# EAGLE design Stepperdriver (EAGLE 6.5.0)
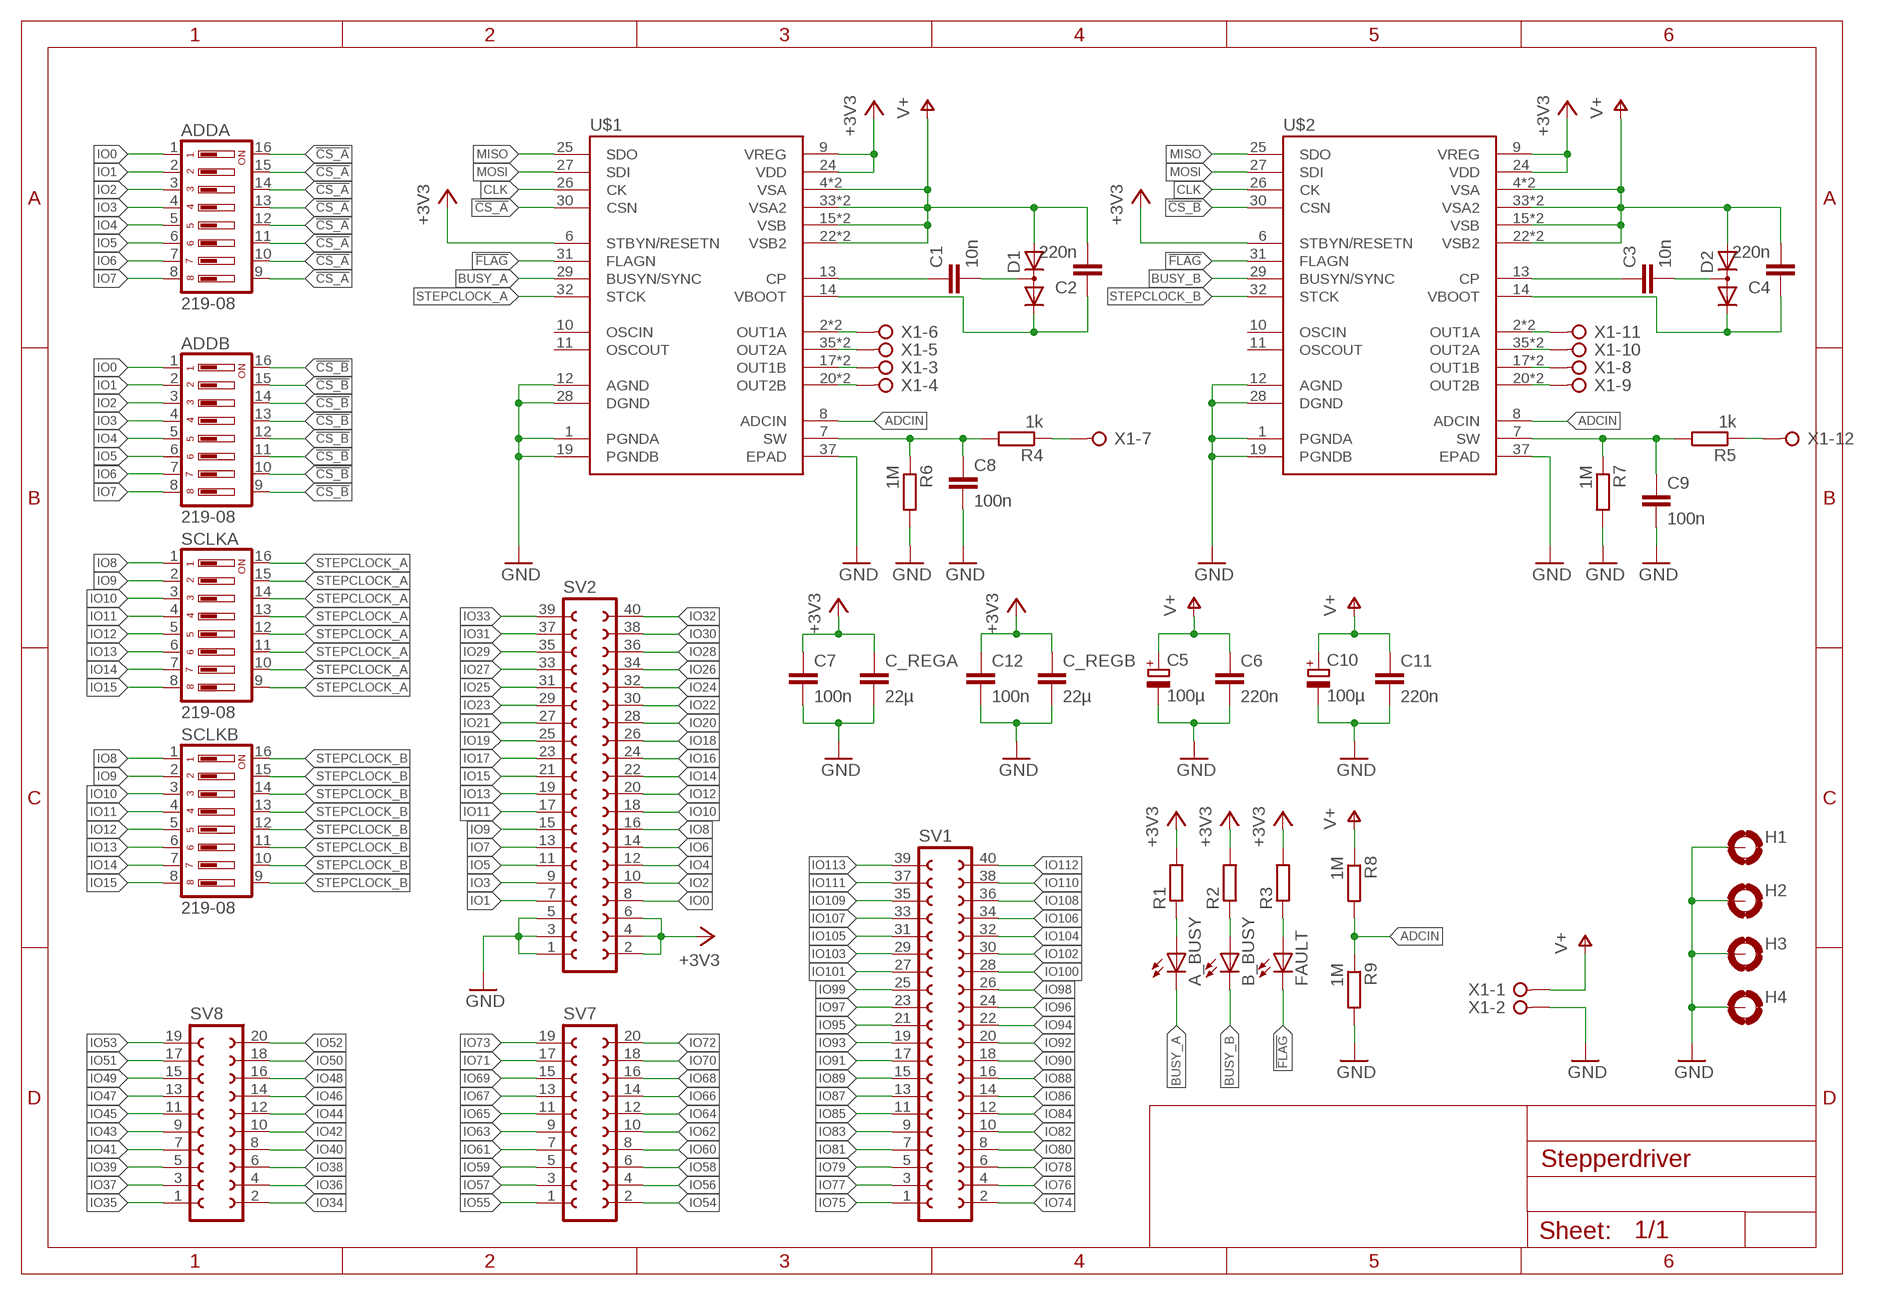
[diagram p0: schematic, sheet 1]

## Parts
A_BUSY  LEDCHIP-LED0805  [CHIP-LED0805]
ADDA  219-08  [CTS-219-08]
ADDB  219-08  [CTS-219-08]
B_BUSY  LEDCHIP-LED0805  [CHIP-LED0805]
C1  10n  C-EUC0805  [C0805]
C2  220n  C-EUC0805  [C0805]
C3  10n  C-EUC0805  [C0805]
C4  220n  C-EUC0805  [C0805]
C5  100µ  CPOL-EU150CLZ-1010  [150CLZ-1010]
C6  220n  C-EUC0805  [C0805]
C7  100n  C-EUC0805  [C0805]
C8  100n  C-EUC0805  [C0805]
C9  100n  C-EUC0805  [C0805]
C10  100µ  CPOL-EU150CLZ-1010  [150CLZ-1010]
C11  220n  C-EUC0805  [C0805]
C12  100n  C-EUC0805  [C0805]
C_REGA  22µ  C-EUC0805  [C0805]
C_REGB  22µ  C-EUC0805  [C0805]
D1  DIODE_2CACA-SOT23  [SOT23]
D2  DIODE_2CACA-SOT23  [SOT23]
FAULT  LEDCHIP-LED0805  [CHIP-LED0805]
H1  MOUNT-PAD-ROUND5.0  [5,0-PAD]
H2  MOUNT-PAD-ROUND5.0  [5,0-PAD]
H3  MOUNT-PAD-ROUND5.0  [5,0-PAD]
H4  MOUNT-PAD-ROUND5.0  [5,0-PAD]
R1  R-EU_R0805  [R0805]
R2  R-EU_R0805  [R0805]
R3  R-EU_R0805  [R0805]
R4  1k  R-EU_R0805  [R0805]
R5  1k  R-EU_R0805  [R0805]
R6  1M  R-EU_R0805  [R0805]
R7  1M  R-EU_R0805  [R0805]
R8  1M  R-EU_R0805  [R0805]
R9  1M  R-EU_R0805  [R0805]
SCLKA  219-08  [CTS-219-08]
SCLKB  219-08  [CTS-219-08]
SV1  FE20-2  [FE20-2]
SV2  FE20-2  [FE20-2]
SV7  FE10-2  [FE10-2]
SV8  FE10-2  [FE10-2]
U$1  L6470HPOWERSO36  [SOP65P1400X360-37N]
U$2  L6470HPOWERSO36  [SOP65P1400X360-37N]
X1  W237-12P  [W237-12P]

## Nets
!CS_A: ADDA.9 ADDA.10 ADDA.11 ADDA.12 ADDA.13 ADDA.14 ADDA.15 ADDA.16 U$1.30(CSN)
!CS_B: ADDB.9 ADDB.10 ADDB.11 ADDB.12 ADDB.13 ADDB.14 ADDB.15 ADDB.16 U$2.30(CSN)
!FLAG: FAULT.C U$1.31(FLAGN) U$2.31(FLAGN)
+3V3: C7.1 C12.1 C_REGA.1 C_REGB.1 R1.2 R2.2 R3.2 SV2.2 SV2.4 SV2.6 U$1.6(STBYN/RESETN) U$1.9(VREG) U$1.24(VDD) U$2.6(STBYN/RESETN) U$2.9(VREG) U$2.24(VDD)
ADCIN: R8.2 R9.1 U$1.8(ADCIN) U$2.8(ADCIN)
BUSY_A: A_BUSY.C U$1.29(BUSYN/SYNC)
BUSY_B: B_BUSY.C U$2.29(BUSYN/SYNC)
CLK: U$1.26(CK) U$2.26(CK)
GND: C5.- C6.2 C7.2 C8.2 C9.2 C10.- C11.2 C12.2 C_REGA.2 C_REGB.2 H1.B5(MOUNT) H2.B5(MOUNT) H3.B5(MOUNT) H4.B5(MOUNT) R6.2 R7.2 R9.2 SV2.1 SV2.3 SV2.5 U$1.1(PGNDA) U$1.12(AGND) U$1.19(PGNDB) U$1.28(DGND) U$1.37(EPAD) U$2.1(PGNDA) U$2.12(AGND) U$2.19(PGNDB) U$2.28(DGND) U$2.37(EPAD) X1.2
IO0: ADDA.1 ADDB.1 SV2.8
IO1: ADDA.2 ADDB.2 SV2.7
IO2: ADDA.3 ADDB.3 SV2.10
IO3: ADDA.4 ADDB.4 SV2.9
IO4: ADDA.5 ADDB.5 SV2.12
IO5: ADDA.6 ADDB.6 SV2.11
IO6: ADDA.7 ADDB.7 SV2.14
IO7: ADDA.8 ADDB.8 SV2.13
IO8: SCLKA.1 SCLKB.1 SV2.16
IO9: SCLKA.2 SCLKB.2 SV2.15
IO10: SCLKA.3 SCLKB.3 SV2.18
IO11: SCLKA.4 SCLKB.4 SV2.17
IO12: SCLKA.5 SCLKB.5 SV2.20
IO13: SCLKA.6 SCLKB.6 SV2.19
IO14: SCLKA.7 SCLKB.7 SV2.22
IO15: SCLKA.8 SCLKB.8 SV2.21
IO16: SV2.24
IO17: SV2.23
IO18: SV2.26
IO19: SV2.25
IO20: SV2.28
IO21: SV2.27
IO22: SV2.30
IO23: SV2.29
IO24: SV2.32
IO25: SV2.31
IO26: SV2.34
IO27: SV2.33
IO28: SV2.36
IO29: SV2.35
IO30: SV2.38
IO31: SV2.37
IO32: SV2.40
IO33: SV2.39
IO34: SV8.2
IO35: SV8.1
IO36: SV8.4
IO37: SV8.3
IO38: SV8.6
IO39: SV8.5
IO40: SV8.8
IO41: SV8.7
IO42: SV8.10
IO43: SV8.9
IO44: SV8.12
IO45: SV8.11
IO46: SV8.14
IO47: SV8.13
IO48: SV8.16
IO49: SV8.15
IO50: SV8.18
IO51: SV8.17
IO52: SV8.20
IO53: SV8.19
IO54: SV7.2
IO55: SV7.1
IO56: SV7.4
IO57: SV7.3
IO58: SV7.6
IO59: SV7.5
IO60: SV7.8
IO61: SV7.7
IO62: SV7.10
IO63: SV7.9
IO64: SV7.12
IO65: SV7.11
IO66: SV7.14
IO67: SV7.13
IO68: SV7.16
IO69: SV7.15
IO70: SV7.18
IO71: SV7.17
IO72: SV7.20
IO73: SV7.19
IO74: SV1.2
IO75: SV1.1
IO76: SV1.4
IO77: SV1.3
IO78: SV1.6
IO79: SV1.5
IO80: SV1.8
IO81: SV1.7
IO82: SV1.10
IO83: SV1.9
IO84: SV1.12
IO85: SV1.11
IO86: SV1.14
IO87: SV1.13
IO88: SV1.16
IO89: SV1.15
IO90: SV1.18
IO91: SV1.17
IO92: SV1.20
IO93: SV1.19
IO94: SV1.22
IO95: SV1.21
IO96: SV1.24
IO97: SV1.23
IO98: SV1.26
IO99: SV1.25
IO100: SV1.28
IO101: SV1.27
IO102: SV1.30
IO103: SV1.29
IO104: SV1.32
IO105: SV1.31
IO106: SV1.34
IO107: SV1.33
IO108: SV1.36
IO109: SV1.35
IO110: SV1.38
IO111: SV1.37
IO112: SV1.40
IO113: SV1.39
MISO: U$1.25(SDO) U$2.25(SDO)
MOSI: U$1.27(SDI) U$2.27(SDI)
N$1: U$1.2(OUT1A) U$1.3(OUT1A) X1.6
N$2: U$1.35(OUT2A) U$1.36(OUT2A) X1.5
N$3: U$1.17(OUT1B) U$1.18(OUT1B) X1.3
N$4: U$1.20(OUT2B) U$1.21(OUT2B) X1.4
N$5: U$2.20(OUT2B) U$2.21(OUT2B) X1.9
N$6: U$2.17(OUT1B) U$2.18(OUT1B) X1.8
N$7: U$2.35(OUT2A) U$2.36(OUT2A) X1.10
N$8: U$2.2(OUT1A) U$2.3(OUT1A) X1.11
N$61: C3.1 U$2.13(CP)
N$62: C3.2 D2.3(AC)
N$63: C4.1 D2.2(C) U$2.14(VBOOT)
N$67: A_BUSY.A R1.1
N$71: C1.1 U$1.13(CP)
N$74: C1.2 D1.3(AC)
N$75: C2.1 D1.2(C) U$1.14(VBOOT)
N$76: R5.1 X1.12
N$77: B_BUSY.A R2.1
N$78: FAULT.A R3.1
N$82: C9.1 R5.2 R7.1 U$2.7(SW)
N$83: C8.1 R4.2 R6.1 U$1.7(SW)
N$84: R4.1 X1.7
STEPCLOCK_A: SCLKA.9 SCLKA.10 SCLKA.11 SCLKA.12 SCLKA.13 SCLKA.14 SCLKA.15 SCLKA.16 U$1.32(STCK)
STEPCLOCK_B: SCLKB.9 SCLKB.10 SCLKB.11 SCLKB.12 SCLKB.13 SCLKB.14 SCLKB.15 SCLKB.16 U$2.32(STCK)
V+: C2.2 C4.2 C5.+ C6.1 C10.+ C11.1 D1.1(A) D2.1(A) R8.1 U$1.4(VSA) U$1.5(VSA) U$1.15(VSB) U$1.16(VSB) U$1.22(VSB2) U$1.23(VSB2) U$1.33(VSA2) U$1.34(VSA2) U$2.4(VSA) U$2.5(VSA) U$2.15(VSB) U$2.16(VSB) U$2.22(VSB2) U$2.23(VSB2) U$2.33(VSA2) U$2.34(VSA2) X1.1
Unconnected: U$1.10(OSCIN) U$1.11(OSCOUT) U$2.10(OSCIN) U$2.11(OSCOUT)

## Library data of the parts
A_BUSY B_BUSY FAULT = led:LED: LED OSRAM: - CHIPLED LG R971, LG N971, LY N971, LG Q971, LY Q971, LO R971, LY R971 LH N974, LH R974 LS Q976, LO Q976, LY Q976 LO Q996 - Hyper CHIPLED LW Q18S LB Q993, LB Q99A, LB R99A - SideLED LS A670, LO A670, LY A670, LG A670, LP A670 LB A673, LV A673, LT A673, LW A673 LH A674 LY A675 LS A676, LA A676, LO A676, LY A676, LW A676 LS A679, LY A679, LG A679 - Hyper Micro SIDELED® LS Y876, LA Y876, LO Y876, LY Y876 LT Y87S - SmartLED LW L88C, LW L88S LB L89C, LB L89S, LG L890 LS L89K, LO L89K, LY L89K LS L896, LA L896, LO L896, LY L896 - TOPLED LS T670, LO T670, LY T670, LG T670, LP T670 LSG T670, LSP T670, LSY T670, LOP T670, LYG T670 LG T671, LOG T671, LSG T671 LB T673, LV T673, LT T673, LW T673 LH T674 LS T676, LA T676, LO T676, LY T676, LB T676, LH T676, LSB T676, LW T676 LB T67C, LV T67C, LT T67C, LS T67K, LO T67K, LY T67K, LW E67C LS E67B, LA E67B, LO E67B, LY E67B, LB E67C, LV E67C, LT E67C LW T67C LS T679, LY T679, LG T679 LS T770, LO T770, LY T770, LG T770, LP T770 LB T773, LV T773, LT T773, LW T773 LH T774 LS E675, LA E675, LY E675, LS T675 LS T776, LA T776, LO T776, LY T776, LB T776 LHGB T686 LT T68C, LB T68C - Hyper Mini TOPLED® LB M676 - Mini TOPLED Santana® LG M470 LS M47K, LO M47K, LY M47K Source: http://www.osram.convergy.de LUXEON: - LUMILED® LXK2-PW12-R00, LXK2-PW12-S00, LXK2-PW14-U00, LXK2-PW14-V00 LXK2-PM12-R00, LXK2-PM12-S00, LXK2-PM14-U00 LXK2-PE12-Q00, LXK2-PE12-R00, LXK2-PE12-S00, LXK2-PE14-T00, LXK2-PE14-U00 LXK2-PB12-K00, LXK2-PB12-L00, LXK2-PB12-M00, LXK2-PB14-N00, LXK2-PB14-P00, LXK2-PB14-Q00 LXK2-PR12-L00, LXK2-PR12-M00, LXK2-PR14-Q00, LXK2-PR14-R00 LXK2-PD12-Q00, LXK2-PD12-R00, LXK2-PD12-S00 LXK2-PH12-R00, LXK2-PH12-S00 LXK2-PL12-P00, LXK2-PL12-Q00, LXK2-PL12-R00 Source: www.luxeon.com KINGBRIGHT: KA-3528ASYC Source: www.kingbright.com
ADDA ADDB SCLKA SCLKB = switch-dil:219-08*: Surface Mount DIP Switch Series 219 SMT CTS Electronic Components Sourc: www.ctscorp.com; OC_FARNELL: unknown; OC_NEWARK: unknown
C1-C4 C6-C9 C11 C12 C_REGA C_REGB = rcl:C-EU: CAPACITOR, European symbol
C5 C10 = rcl:CPOL-EU: POLARIZED CAPACITOR, European symbol
D1 D2 = diode:DIODE_2CACA-: 2 Diodes - Cathode-Anode|Cathode-Anode
H1-H4 = holes:MOUNT-PAD-ROUND: MOUNTING PAD, round
R1-R9 = rcl:R-EU_: RESISTOR, European symbol
SV1 SV2 = con-lsta:FE20-2: FEMALE HEADER; OC_FARNELL: unknown; OC_NEWARK: unknown
SV7 SV8 = con-lsta:FE10-2: FEMALE HEADER; OC_FARNELL: unknown; OC_NEWARK: unknown
U$1 U$2 = Hardware:L6470H
X1 = con-wago-508:W237-12P: WAGO SREW CLAMP; OC_FARNELL: unknown; OC_NEWARK: unknown

## Board
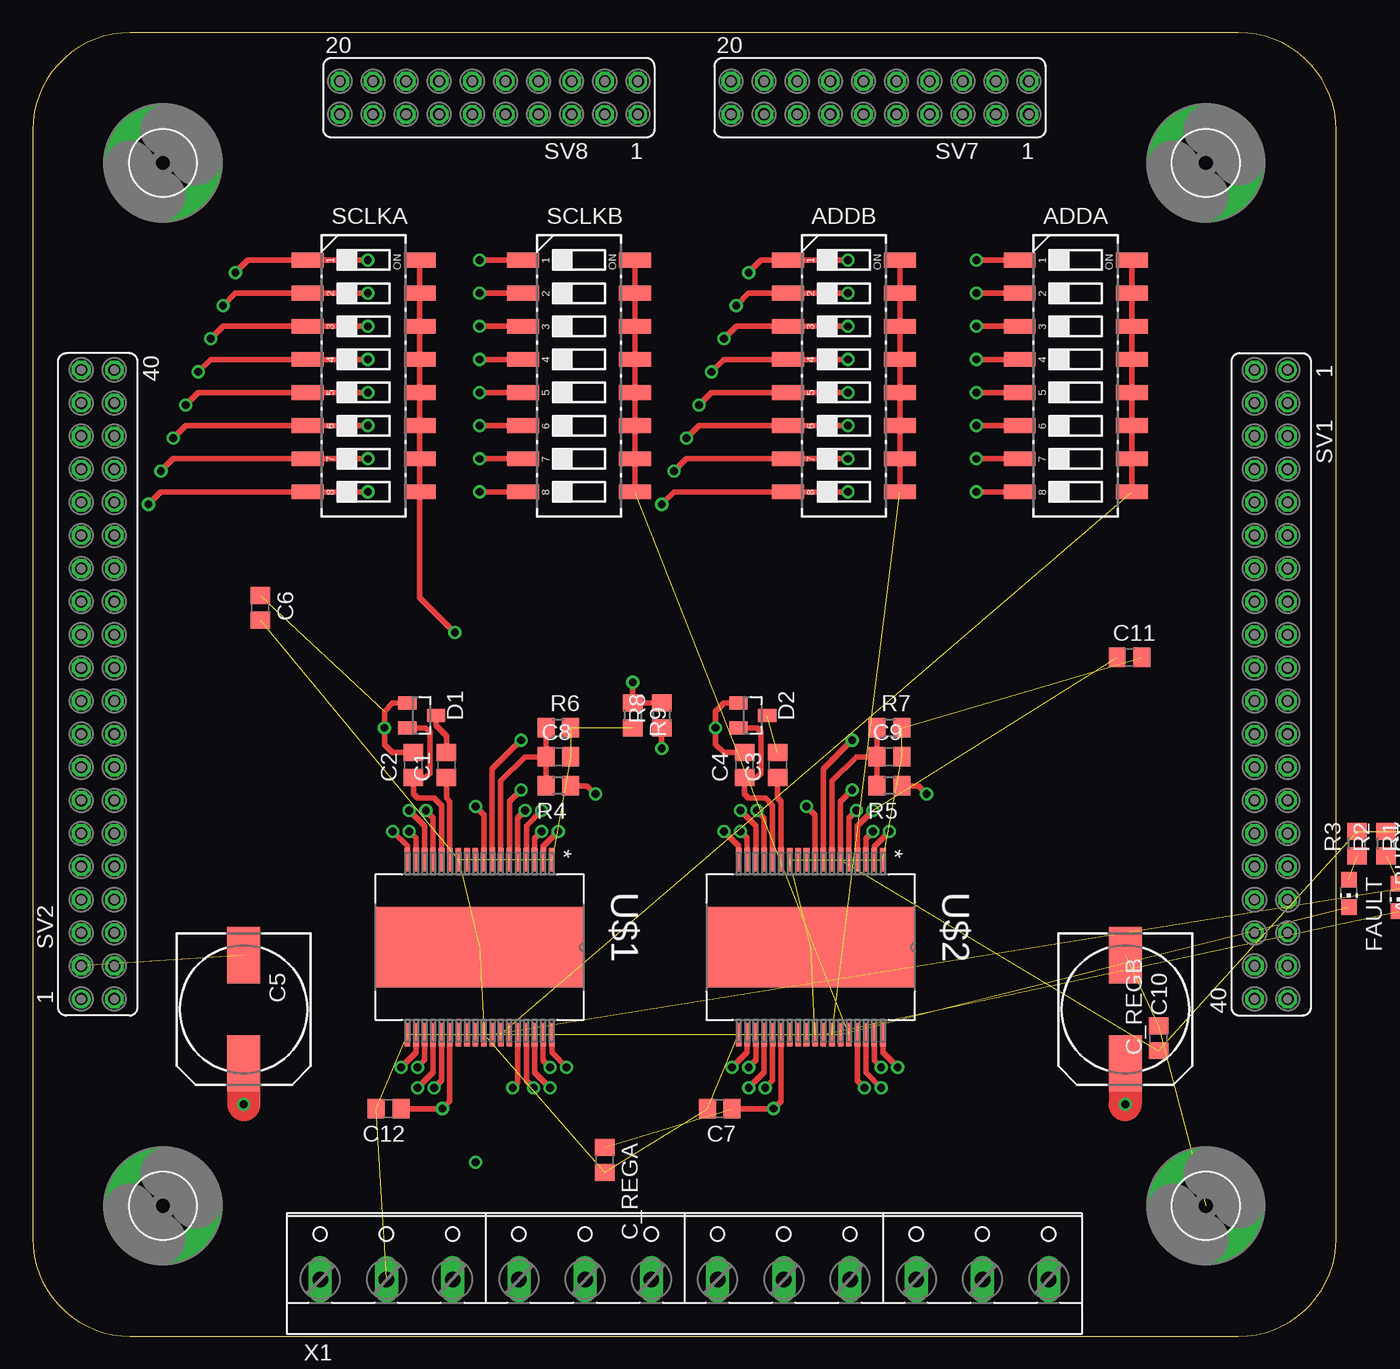
[diagram p1: board, top side]
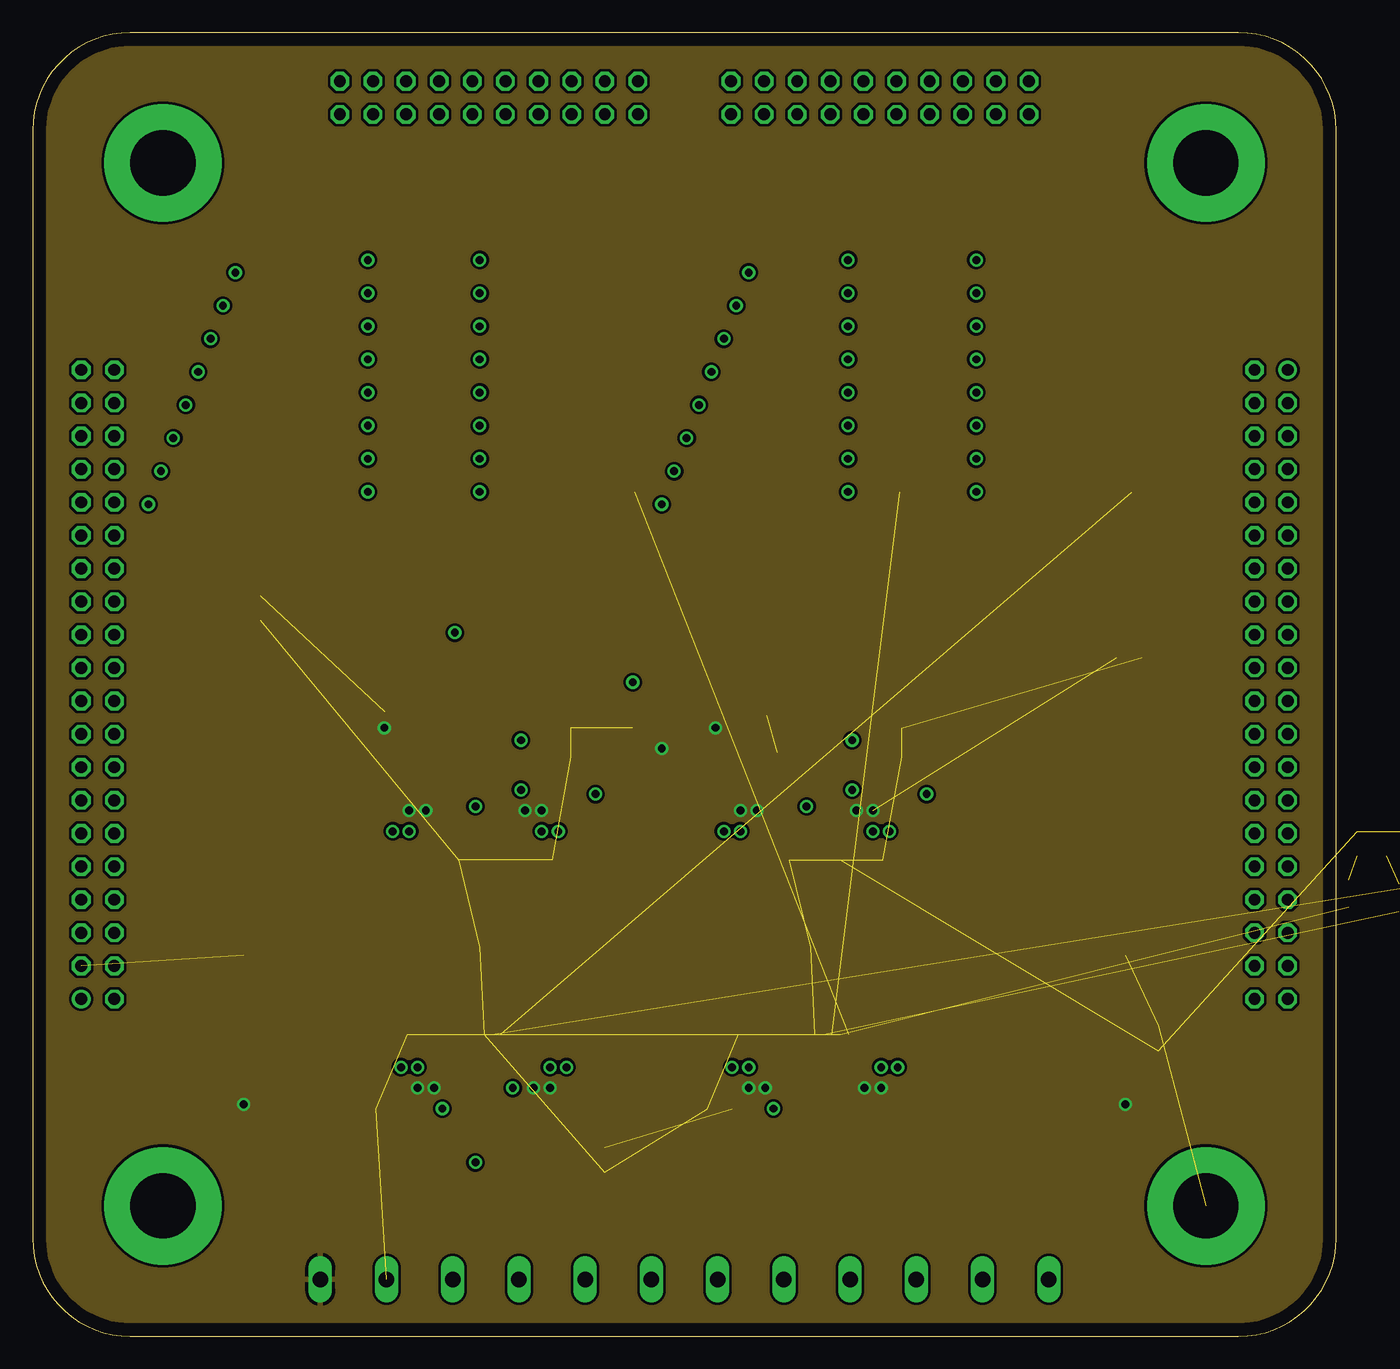
[diagram p2: board, inner layer PowerVCC]
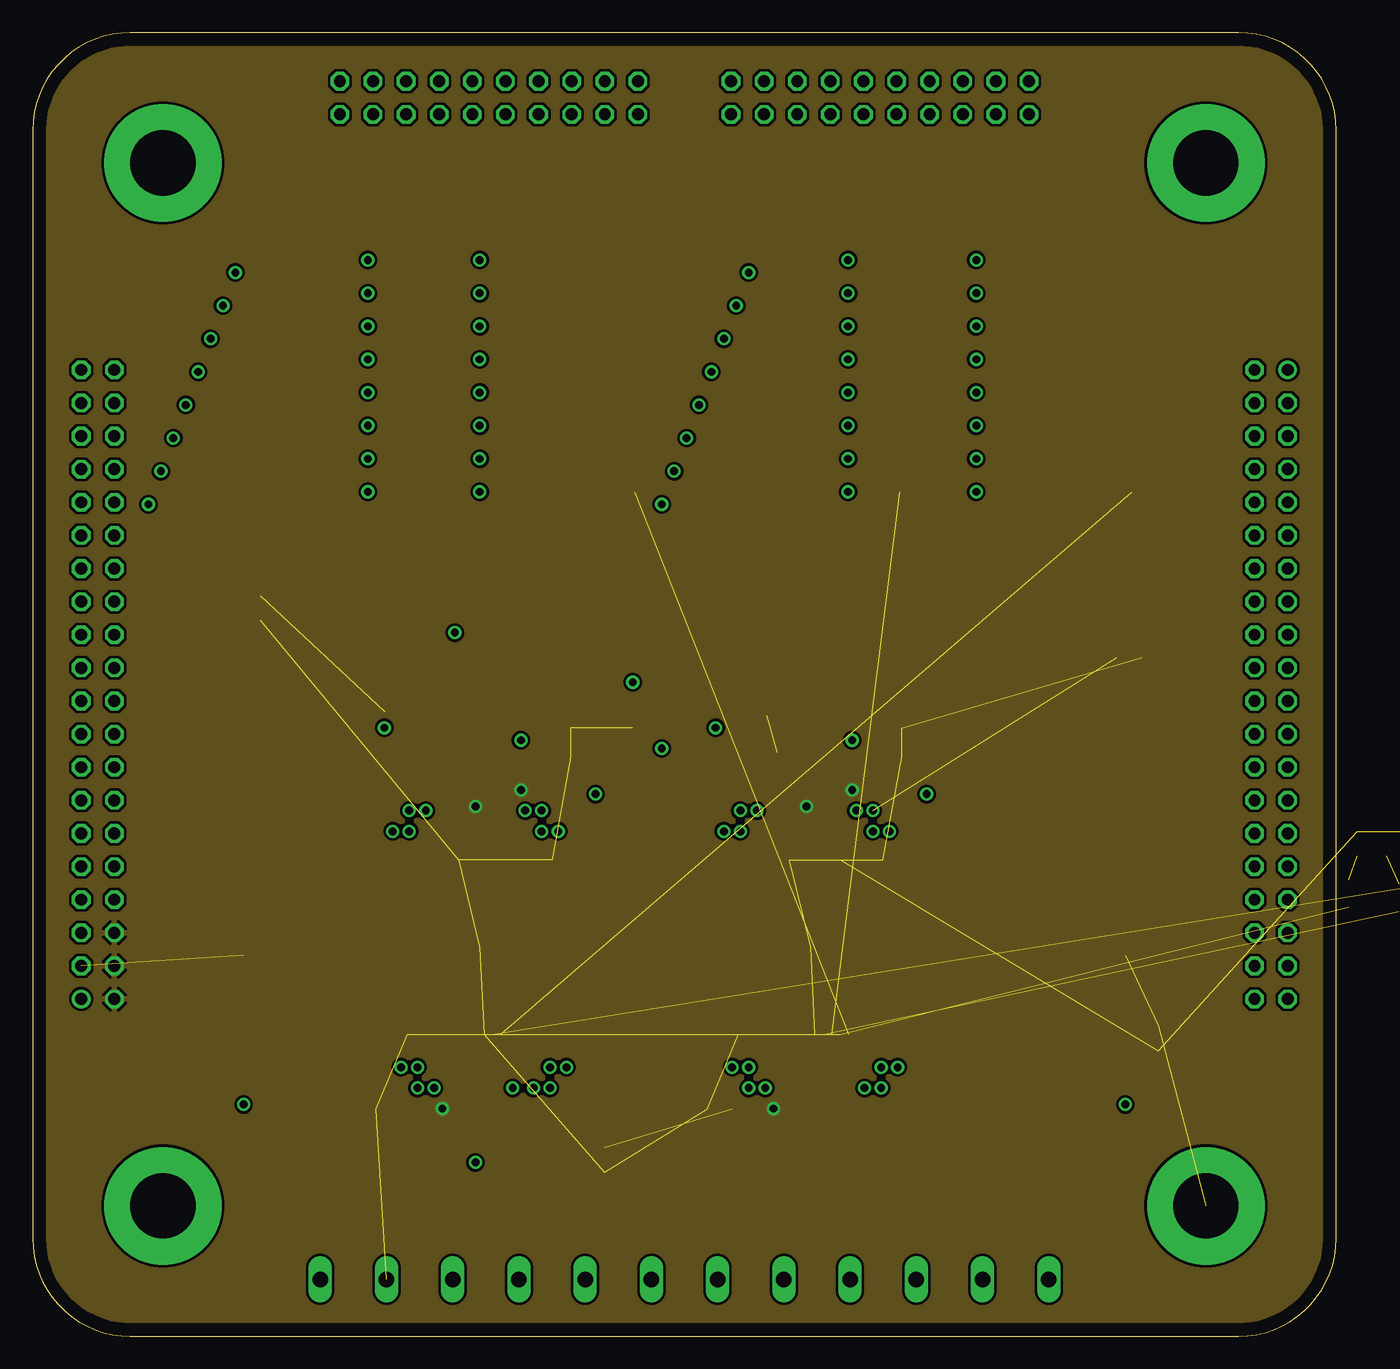
[diagram p3: board, inner layer DVCC]
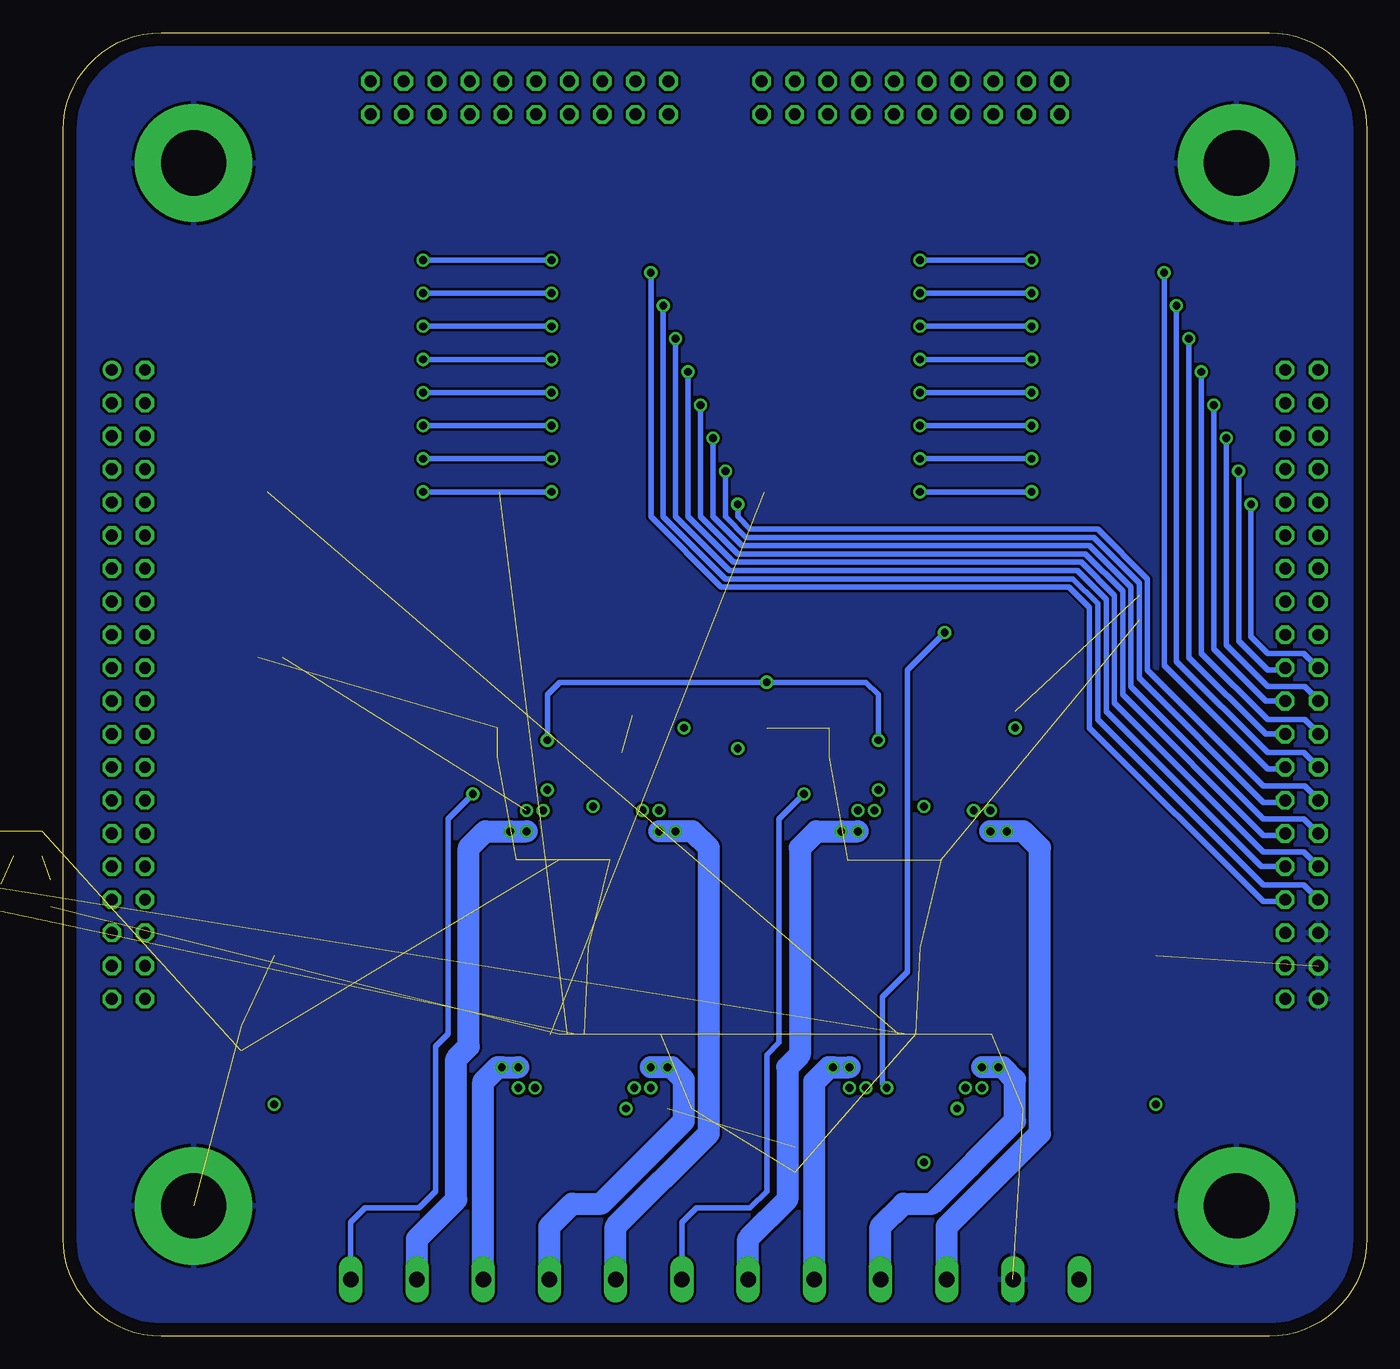
[diagram p4: board, bottom side, seen from below]

Size 100 x 100 mm. Coordinates in mm from the lower left corner, seen from the top.
Outline: 0,92.5 0,7.5 arc90 7.5,0 92.5,0 arc90 100,7.5 100,92.5 arc90 92.5,100 7.5,100 arc90 0,92.5
Copper layers ((1+2)*(15+16)): TopGND 0.035mm / dielectric 1.5mm / PowerVCC 0.035mm / dielectric 0.15mm / DVCC 0.035mm / dielectric 0.2mm / BottomGND 0.035mm
Design rules "default *": minimum track width 10mil, minimum drill 24mil, track to track 8mil, track to pad 8mil, pad to pad 8mil, via to via 8mil, smd to smd 8mil, copper to edge 40mil, drill to drill 8mil, minimum pad ring 10mil, minimum via ring 8mil, stop-mask expansion 4mil, vias tented up to drill 0mil, thermal gap 10mil

### Footprints (pad centres in the part's own frame; a part is rotated, then mirrored left to right if it is on the bottom)
CHIP-LED0805 = smd 1.2 x 1.2: A 0,-1.05; C 0,1.05
CTS-219-08 = smd 1.13 x 2.44: 1 -8.89,-4.3; 2 -6.35,-4.3; 3 -3.81,-4.3; 4 -1.27,-4.3; 5 1.27,-4.3; 6 3.81,-4.3; 7 6.35,-4.3; 8 8.89,-4.3; 9 8.89,4.3; 10 6.35,4.3; 11 3.81,4.3; 12 1.27,4.3; 13 -1.27,4.3; 14 -3.81,4.3; 15 -6.35,4.3; 16 -8.89,4.3
C0805 = smd 1.3 x 1.5: 1 -0.95,0; 2 0.95,0
150CLZ-1010 = smd 4.3 x 2.5: + 4.15,0; - -4.15,0
SOT23 = smd 1 x 1.4: 1 -0.95,-1.1; 2 0.95,-1.1; 3 0,1.1
5,0-PAD = drill 5 pad 9: B5 0,0
R0805 = smd 1.3 x 1.5: 1 -0.95,0; 2 0.95,0
FE20-2 = drill 0.914: 1 -24.13,1.27 | drill 0.914 octagon: 2 -24.13,-1.27; 3 -21.59,1.27; 4 -21.59,-1.27; 5 -19.05,1.27; 6 -19.05,-1.27; 7 -16.51,1.27; 8 -16.51,-1.27; 9 -13.97,1.27; 10 -13.97,-1.27; 11 -11.43,1.27; 12 -11.43,-1.27; 13 -8.89,1.27; 14 -8.89,-1.27; 15 -6.35,1.27; 16 -6.35,-1.27; 17 -3.81,1.27; 18 -3.81,-1.27; 19 -1.27,1.27; 20 -1.27,-1.27; 21 1.27,1.27; 22 1.27,-1.27; 23 3.81,1.27; 24 3.81,-1.27; 25 6.35,1.27; 26 6.35,-1.27; 27 8.89,1.27; 28 8.89,-1.27; 29 11.43,1.27; 30 11.43,-1.27; 31 13.97,1.27; 32 13.97,-1.27; 33 16.51,1.27; 34 16.51,-1.27; 35 19.05,1.27; 36 19.05,-1.27; 37 21.59,1.27; 38 21.59,-1.27; 39 24.13,1.27; 40 24.13,-1.27
FE10-2 = drill 0.914 octagon: 1 -11.43,1.27; 2 -11.43,-1.27; 3 -8.89,1.27; 4 -8.89,-1.27; 5 -6.35,1.27; 6 -6.35,-1.27; 7 -3.81,1.27; 8 -3.81,-1.27; 9 -1.27,1.27; 10 -1.27,-1.27; 11 1.27,1.27; 12 1.27,-1.27; 13 3.81,1.27; 14 3.81,-1.27; 15 6.35,1.27; 16 6.35,-1.27; 17 8.89,1.27; 18 8.89,-1.27; 19 11.43,1.27; 20 11.43,-1.27
SOP65P1400X360-37N = smd 1.803 x 0.432: 1 -6.706,5.537; 2 -6.706,4.877; 3 -6.706,4.216; 4 -6.706,3.581; 5 -6.706,2.921; 6 -6.706,2.286; 7 -6.706,1.626; 8 -6.706,0.965; 9 -6.706,0.33; 10 -6.706,-0.33; 11 -6.706,-0.965; 12 -6.706,-1.626; 13 -6.706,-2.286; 14 -6.706,-2.921; 15 -6.706,-3.581; 16 -6.706,-4.216; 17 -6.706,-4.877; 18 -6.706,-5.537; 19 6.706,-5.537; 20 6.706,-4.877; 21 6.706,-4.216; 22 6.706,-3.581; 23 6.706,-2.921; 24 6.706,-2.286; 25 6.706,-1.626; 26 6.706,-0.965; 27 6.706,-0.33; 28 6.706,0.33; 29 6.706,0.965; 30 6.706,1.626; 31 6.706,2.286; 32 6.706,2.921; 33 6.706,3.581; 34 6.706,4.216; 35 6.706,4.877; 36 6.706,5.537 | smd 6.198 x 16.002: 37 0,0
W237-12P = drill 1.194 long: 1 -27.94,-0.635; 2 -22.86,-0.635; 3 -17.78,-0.635; 4 -12.7,-0.635; 5 -7.62,-0.635; 6 -2.54,-0.635; 7 2.54,-0.635; 8 7.62,-0.635; 9 12.7,-0.635; 10 17.78,-0.635; 11 22.86,-0.635; 12 27.94,-0.635

### Placement (x,y rotation side)
A_BUSY  107,33.66 0 top  (outside the outline)
ADDA  80.01,73.66 270 top
ADDB  62.23,73.66 270 top
B_BUSY  104.78,33.66 180 top  (outside the outline)
C1  31.75,43.81 90 top
C2  29.21,43.81 90 top
C3  57.15,43.81 90 top
C4  54.61,43.81 90 top
C5  16.19,25.08 270 top
C6  17.46,55.88 270 top
C7  52.7,17.46 180 top
C8  40.32,44.45 0 top
C9  65.72,44.45 0 top
C10  83.82,25.08 270 top
C11  84.14,52.07 0 top
C12  27.3,17.46 180 top
C_REGA  43.88,13.54 270 top
C_REGB  86.36,22.86 90 top
D1  29.84,47.62 270 top
D2  55.24,47.62 270 top
FAULT  100.97,33.97 180 top
H1  10,10 0 top
H2  90,10 0 top
H3  10,90 0 top
H4  90,90 0 top
R1  106.05,37.78 90 top  (outside the outline)
R2  103.82,37.78 90 top  (outside the outline)
R3  101.6,37.78 90 top
R4  40.32,42.23 180 top
R5  65.72,42.23 180 top
R6  40.32,46.67 0 top
R7  65.72,46.67 0 top
R8  48.26,47.62 90 top
R9  46.04,47.62 270 top
SCLKA  25.4,73.66 270 top
SCLKB  41.91,73.66 270 top
SV1  95,50 270 top
SV2  5,50 90 top
SV7  65,95 180 top
SV8  35,95 180 top
U$1  34.29,29.84 270 top
U$2  59.69,29.84 270 top
X1  50,5 0 top

### Tracks (layer width: path | path; a pad name or v marks a point on that pad's centre or on a via)
!CS_A  (1 unrouted)
  TopGND 0.406: ADDA.16 ADDA.15 ADDA.14 ADDA.13 ADDA.12 ADDA.11 ADDA.10 ADDA.9
!CS_B  (1 unrouted)
  TopGND 0.406: ADDB.16 ADDB.15 ADDB.14 ADDB.13 ADDB.12 ADDB.11 ADDB.10 ADDB.9
!FLAG  (2 unrouted)
+3V3  (via drill 0.6)  (5 unrouted)
  TopGND 0.406: U$1.6 36.58,41.02 v37.47,41.91 | U$1.9 34.62,39.99 v33.97,40.64 | U$1.24 32,18.03 v31.43,17.46 C12.1 | U$2.6 61.98,41.02 v62.87,41.91 | U$2.24 57.4,18.03 v56.83,17.46 C7.1 | U$2.9 60.02,39.99 v59.37,40.64
  pour DVCC: 8,0 arc-90 0,8 0,93 arc-90 7,100 92,100 arc-90 100,92 100,7 arc-90 93,0
ADCIN  (via drill 0.6)
  TopGND 0.406: R8.2 R9.1 v46.04,50.16 | U$1.8 35.26,43.51 v37.47,45.72 | U$2.8 60.66,43.51 v62.87,45.72
  BottomGND 0.406: v37.47,45.72 37.47,49.21 38.42,50.16 v46.04,50.16 61.91,50.16 62.87,49.21 v62.87,45.72
BUSY_A  (1 unrouted)
BUSY_B  (1 unrouted)
CLK  (1 unrouted)
GND  (23 unrouted)
  pour BottomGND: 8,0 arc-90 0,8 0,93 arc-90 7,100 8,100 92,100 arc-90 100,92 100,7 arc-90 93,0
  cutout TopGND: 8,0 arc-90 0,8 0,93 arc-90 7,100 8,100 92,100 arc-90 100,92 100,7 arc-90 93,0
IO0  (via drill 0.6)
  TopGND 0.406: v54.93,81.6 55.88,82.55 ADDB.1 v62.55,82.55 | ADDA.1 v72.39,82.55
  BottomGND 0.406: v54.93,81.6 54.93,62.87 49.53,57.47 22.86,57.47 21.27,55.88 21.27,46.67 7.94,33.34 6.42,33.34 SV2.8 | v72.39,82.55 v62.55,82.55
IO1  (via drill 0.6)
  TopGND 0.406: v53.98,79.06 54.93,80.01 ADDB.2 v62.55,80.01 | ADDA.2 v72.39,80.01
  BottomGND 0.406: v53.98,79.06 53.98,62.87 49.21,58.1 22.54,58.1 20.64,56.2 20.64,47.31 7.94,34.61 4.85,34.61 SV2.7 | v72.39,80.01 v62.55,80.01
IO2  (via drill 0.6)
  TopGND 0.406: v53.02,76.52 53.98,77.47 ADDB.3 v62.55,77.47 | ADDA.3 v72.39,77.47
  BottomGND 0.406: SV2.10 8.09,36.03 20,47.94 20,56.52 22.23,58.74 48.9,58.74 53.02,62.87 v53.02,76.52 | v72.39,77.47 v62.55,77.47
IO3  (via drill 0.6)
  TopGND 0.406: v52.07,73.98 53.02,74.93 ADDB.4 v62.55,74.93 | ADDA.4 v72.39,74.93
  BottomGND 0.406: v52.07,73.98 52.07,62.87 48.58,59.37 21.91,59.37 19.37,56.83 19.37,48.58 7.94,37.15 4.85,37.15 SV2.9 | v72.39,74.93 v62.55,74.93
IO4  (via drill 0.6)
  TopGND 0.406: v51.12,71.44 52.07,72.39 ADDB.5 v62.55,72.39 | ADDA.5 v72.39,72.39
  BottomGND 0.406: v51.12,71.44 51.12,62.87 48.26,60.01 21.59,60.01 18.73,57.15 18.73,49.21 7.94,38.42 6.42,38.42 SV2.12 | v72.39,72.39 v62.55,72.39
IO5  (via drill 0.6)
  TopGND 0.406: v50.16,68.9 51.12,69.85 ADDB.6 v62.55,69.85 | ADDA.6 v72.39,69.85
  BottomGND 0.406: v50.16,68.9 50.16,62.87 47.94,60.64 21.27,60.64 18.1,57.47 18.1,49.85 7.94,39.69 4.85,39.69 SV2.11 | v72.39,69.85 v62.55,69.85
IO6  (via drill 0.6)
  TopGND 0.406: v49.21,66.36 50.16,67.31 ADDB.7 v62.55,67.31 | ADDA.7 v72.39,67.31
  BottomGND 0.406: v49.21,66.36 49.21,62.87 47.62,61.28 20.95,61.28 17.46,57.78 17.46,50.48 7.94,40.96 6.42,40.96 SV2.14 | v72.39,67.31 v62.55,67.31
IO7  (via drill 0.6)
  TopGND 0.406: v48.26,63.82 49.21,64.77 ADDB.8 v62.55,64.77 | ADDA.8 v72.39,64.77
  BottomGND 0.406: SV2.13 3.73,41.2 4.76,42.23 7.94,42.23 16.83,51.12 16.83,58.1 20.64,61.91 47.31,61.91 48.26,62.87 v48.26,63.82 | v72.39,64.77 v62.55,64.77
IO8  (via drill 0.6)
  TopGND 0.406: v15.56,81.6 16.51,82.55 SCLKA.1 v25.72,82.55 | SCLKB.1 v34.29,82.55
  BottomGND 0.406: v15.56,81.6 15.56,51.44 7.62,43.5 6.42,43.5 SV2.16 | v34.29,82.55 v25.72,82.55
IO9  (via drill 0.6)
  TopGND 0.406: v14.61,79.06 15.56,80.01 SCLKA.2 v25.72,80.01 | SCLKB.2 v34.29,80.01
  BottomGND 0.406: v14.61,79.06 14.61,51.75 7.62,44.77 4.85,44.77 SV2.15 | v34.29,80.01 v25.72,80.01
IO10  (via drill 0.6)
  TopGND 0.406: v13.65,76.52 14.61,77.47 SCLKA.3 v25.72,77.47 | SCLKB.3 v34.29,77.47
  BottomGND 0.406: SV2.18 7.77,46.19 13.65,52.07 v13.65,76.52 | v34.29,77.47 v25.72,77.47
IO11  (via drill 0.6)
  TopGND 0.406: v12.7,73.98 13.65,74.93 SCLKA.4 v25.72,74.93 | SCLKB.4 v34.29,74.93
  BottomGND 0.406: SV2.17 3.73,46.27 4.76,47.31 7.62,47.31 12.7,52.39 v12.7,73.98 | v34.29,74.93 v25.72,74.93
IO12  (via drill 0.6)
  TopGND 0.406: v11.75,71.44 12.7,72.39 SCLKA.5 v25.72,72.39 | SCLKB.5 v34.29,72.39
  BottomGND 0.406: SV2.20 7.77,48.73 11.75,52.7 v11.75,71.44 | v34.29,72.39 v25.72,72.39
IO13  (via drill 0.6)
  TopGND 0.406: v10.79,68.9 11.75,69.85 SCLKA.6 v25.72,69.85 | SCLKB.6 v34.29,69.85
  BottomGND 0.406: SV2.19 3.73,48.81 4.76,49.85 7.62,49.85 10.79,53.02 v10.79,68.9 | v34.29,69.85 v25.72,69.85
IO14  (via drill 0.6)
  TopGND 0.406: v9.84,66.36 10.79,67.31 SCLKA.7 v25.72,67.31 | SCLKB.7 v34.29,67.31
  BottomGND 0.406: v9.84,66.36 9.84,53.34 7.62,51.12 6.42,51.12 SV2.22 | v34.29,67.31 v25.72,67.31
IO15  (via drill 0.6)
  TopGND 0.406: v8.89,63.82 9.84,64.77 SCLKA.8 v25.72,64.77 | SCLKB.8 v34.29,64.77
  BottomGND 0.406: v8.89,63.82 8.89,53.66 7.62,52.39 4.85,52.39 SV2.21 | v34.29,64.77 v25.72,64.77
MISO  (1 unrouted)
MOSI  (1 unrouted)
N$1  (via drill 0.6)
  TopGND 0.406: U$1.3 38.51,38.19 v39.05,38.73 | U$1.2 39.17,37.58 v40.32,38.73
  BottomGND 1.676: v39.05,38.73 v40.32,38.73 42.23,38.73 43.5,37.47 43.5,21.59 44.45,20.64 44.45,10.48 47.46,7.47 X1.6
N$2  (via drill 0.6)
  TopGND 0.406: U$1.35 39.17,21.16 v39.69,20.64 | U$1.36 39.83,21.77 v40.96,20.64
  BottomGND 1.676: X1.5 42.38,19.53 41.27,20.64 v40.96,20.64 v39.69,20.64
N$3  (via drill 0.6)
  TopGND 0.406: U$1.17 29.41,38.21 v28.89,38.73 | U$1.18 28.75,37.6 v27.62,38.73
  BottomGND 1.676: X1.3 32.22,8.42 25.08,15.56 25.08,37.47 26.35,38.73 v27.62,38.73 v28.89,38.73
N$4  (via drill 0.6)
  TopGND 0.406: U$1.21 30.07,21.18 v29.53,20.64 | U$1.20 29.41,21.79 v28.26,20.64
  BottomGND 1.676: v29.53,20.64 v28.26,20.64 27.94,20.64 26.99,19.68 26.99,16.51 33.34,10.16 35.56,10.16 37.3,8.42 X1.4
N$5  (via drill 0.6)
  TopGND 0.406: U$2.21 55.47,21.18 v54.93,20.64 | U$2.20 54.81,21.79 v53.66,20.64
  BottomGND 1.676: X1.9 62.7,8.42 60.96,10.16 58.74,10.16 52.39,16.51 52.39,19.68 53.34,20.64 v53.66,20.64 v54.93,20.64
N$6  (via drill 0.6)
  TopGND 0.406: U$2.17 54.81,38.21 v54.29,38.73 | U$2.18 54.15,37.6 v53.02,38.73
  BottomGND 1.676: X1.8 57.62,8.42 50.48,15.56 50.48,37.47 51.75,38.73 v53.02,38.73 v54.29,38.73
N$7  (via drill 0.6)
  TopGND 0.406: U$2.35 64.57,21.16 v65.09,20.64 | U$2.36 65.23,21.77 v66.36,20.64
  BottomGND 1.676: X1.10 67.78,19.53 66.67,20.64 v66.36,20.64 v65.09,20.64
N$8  (via drill 0.6)
  TopGND 0.406: U$2.3 63.91,38.19 v64.45,38.73 | U$2.2 64.57,37.58 v65.72,38.73
  BottomGND 1.676: X1.11 72.86,7.47 69.85,10.48 69.85,21.27 68.9,22.23 68.9,37.47 67.63,38.73 v65.72,38.73 v64.45,38.73
N$10  (via drill 0.6)
  other vias: 33.97,13.34
N$61
  TopGND 0.406: U$2.13 57.4,41.02 57.15,41.27 C3.1
N$62  (1 unrouted)
N$63
  TopGND 0.406: D2.2 55.56,46.67 55.88,46.35 55.88,43.18 55.56,42.86 C4.1 54.61,41.59 54.93,41.27 56.2,41.27 56.77,40.7 U$2.14
N$67  (1 unrouted)
N$71
  TopGND 0.406: U$1.13 32,41.02 31.75,41.27 C1.1
N$74
  TopGND 0.406: D1.3 30.95,46.84 31.75,46.04 C1.2
N$75
  TopGND 0.406: U$1.14 31.37,40.7 30.8,41.27 29.53,41.27 29.21,41.59 C2.1 30.16,42.86 30.48,43.18 30.48,46.35 30.16,46.67 D1.2
N$76  (via drill 0.6)
  TopGND 0.406: R5.1 67.94,42.23 v68.58,41.59
  BottomGND 0.406: X1.12 77.94,8.74 76.83,9.84 72.71,9.84 71.44,11.11 71.44,22.23 70.48,23.18 70.48,39.69 v68.58,41.59
N$77  (1 unrouted)
N$78  (1 unrouted)
N$82
  TopGND 0.406: U$2.7 61.32,42.58 63.18,44.45 C9.1 | R7.1 C9.1 | C9.1 R5.2
N$83
  TopGND 0.406: R6.1 C8.1 | C8.1 R4.2 | U$1.7 35.92,42.58 37.78,44.45 C8.1
N$84  (via drill 0.6)
  TopGND 0.406: R4.1 42.55,42.23 v43.18,41.59
  BottomGND 0.406: v43.18,41.59 45.09,39.69 45.09,22.54 46.04,21.59 46.04,11.11 47.31,9.84 51.44,9.84 52.54,8.74 X1.7
STEPCLOCK_A  (via drill 0.6)
  TopGND 0.406: SCLKA.16 SCLKA.15 SCLKA.14 SCLKA.13 SCLKA.12 SCLKA.11 SCLKA.10 SCLKA.9 29.7,56.66 v32.38,53.98 | U$1.32 37.21,19.43 v36.83,19.05
  BottomGND 0.406: v32.38,53.98 35.24,51.12 35.24,27.94 37.15,26.04 37.15,19.37 v36.83,19.05
STEPCLOCK_B  (1 unrouted)
  TopGND 0.406: SCLKB.16 SCLKB.15 SCLKB.14 SCLKB.13 SCLKB.12 SCLKB.11 SCLKB.10 SCLKB.9
V+  (via drill 0.6)  (2 unrouted)
  TopGND 0.406: U$1.16 30.07,39.14 v28.89,40.32 | U$1.15 30.71,39.78 v30.16,40.32 | U$1.5 37.21,39.75 v37.78,40.32 | U$1.4 37.87,39.14 v39.05,40.32 | U$1.22 30.71,20.23 v29.53,19.05 | U$1.23 31.37,19.62 v30.8,19.05 | U$1.33 37.87,19.6 v38.42,19.05 | U$1.34 38.51,20.23 v39.69,19.05 | C2.2 27.62,44.77 26.99,45.4 v26.99,46.67 26.99,47.94 27.62,48.58 D1.1 | U$2.4 63.27,39.14 v64.45,40.32 | U$2.5 62.61,39.75 v63.18,40.32 | U$2.16 55.47,39.14 v54.29,40.32 | U$2.15 56.11,39.78 v55.56,40.32 | U$2.22 56.11,20.23 v54.93,19.05 | U$2.23 56.77,19.62 v56.2,19.05 | U$2.34 63.91,20.23 v65.09,19.05 | U$2.33 63.27,19.6 v63.82,19.05 | D2.1 53.02,48.58 52.39,47.94 v52.39,46.67 52.39,45.4 53.02,44.77 C4.2 | R8.1 v48.26,45.09
  TopGND 2.54: C5.+ v16.19,17.78 | C10.+ v83.82,17.78
  pour PowerVCC: 8,0 arc-90 0,8 0,93 arc-90 7,100 92,100 arc-90 100,92 100,7 arc-90 93,0